# EAGLE schematic WHITE_LINE_FINAL_1 (EAGLE 8.2.2)
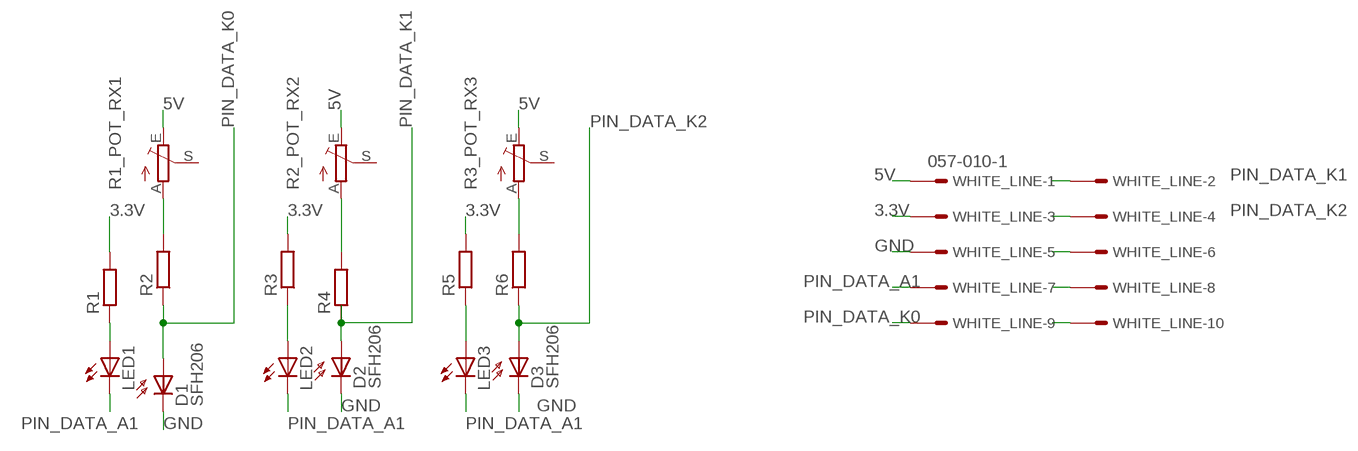
[diagram p0: schematic, sheet 1]

## Parts
D1  SFH206  [SFH206]
D2  SFH206  [SFH206]
D3  SFH206  [SFH206]
LED1  LED-2AC-CP41B-WES  [CP41B]
LED2  LED-2AC-CP41B-WES  [CP41B]
LED3  LED-2AC-CP41B-WES  [CP41B]
R1  R-EU_M1206  [M1206]
R1_POT_RX1  TRIM_EU-CA6V  [CA6V]
R2  R-EU_M1206  [M1206]
R2_POT_RX2  TRIM_EU-CA6V  [CA6V]
R3  R-EU_M1206  [M1206]
R3_POT_RX3  TRIM_EU-CA6V  [CA6V]
R4  R-EU_M1206  [M1206]
R5  R-EU_M1206  [M1206]
R6  R-EU_M1206  [M1206]
WHITE_LINE  057-010-1  [057-010-1]

## Nets
3.3V: R1.2 R3.2 R5.2 WHITE_LINE.3
5V: R1_POT_RX1.E R2_POT_RX2.E R3_POT_RX3.E WHITE_LINE.1
GND: D1.K(C) D2.K(C) D3.K(C) WHITE_LINE.5
N$1: R1_POT_RX1.A R2.2
N$2: LED2.2(A) LED2.3(A) R3.1
N$3: R2_POT_RX2.A R4.2
N$5: R3_POT_RX3.A R6.2
N$7: LED3.2(A) LED3.3(A) R5.1
N$9: LED1.2(A) LED1.3(A) R1.1
N$14: WHITE_LINE.6
N$15: WHITE_LINE.8
N$16: WHITE_LINE.10
PIN_DATA_A1: LED1.1(C) LED1.4(C) LED2.1(C) LED2.4(C) LED3.1(C) LED3.4(C) WHITE_LINE.7
PIN_DATA_K0: D1.A R2.1 WHITE_LINE.9
PIN_DATA_K1: D2.A R4.1 WHITE_LINE.2
PIN_DATA_K2: D3.A R6.1 WHITE_LINE.4
Unconnected: R1_POT_RX1.S R2_POT_RX2.S R3_POT_RX3.S

## Library data of the parts
D1-D3 = opto-trans-siemens:SFH206: PHOTO DIODE; MPN: SFH206K; OC_FARNELL: 1212741; OC_NEWARK: 01M8807
LED1-LED3 = led:LED-2AC-: LEDs with 2 Cathode & 2 Anode - Kingbright SUPER FLUX LED LAMP Source: www.us.kingbright.com/images/catalog/SPEC/W7676CPBC-H.pdf Cree® P4 LED CP41B-WES/WGS Source: Data sheet <http://www.cree.com/products/pdf/LEDlamps/CP41B-WES&WGS.pdf>
R1-R6 = rcl:R-EU_: RESISTOR, European symbol
R1_POT_RX1 R2_POT_RX2 R3_POT_RX3 = pot:TRIM_EU-: POTENTIOMETER
WHITE_LINE = con-panduit:057-010-: CONNECTOR 10-pin series 057 contact pc board low profile headers; OC_FARNELL: unknown; OC_NEWARK: unknown